# Altium project HV_Indicator.PrjPcb
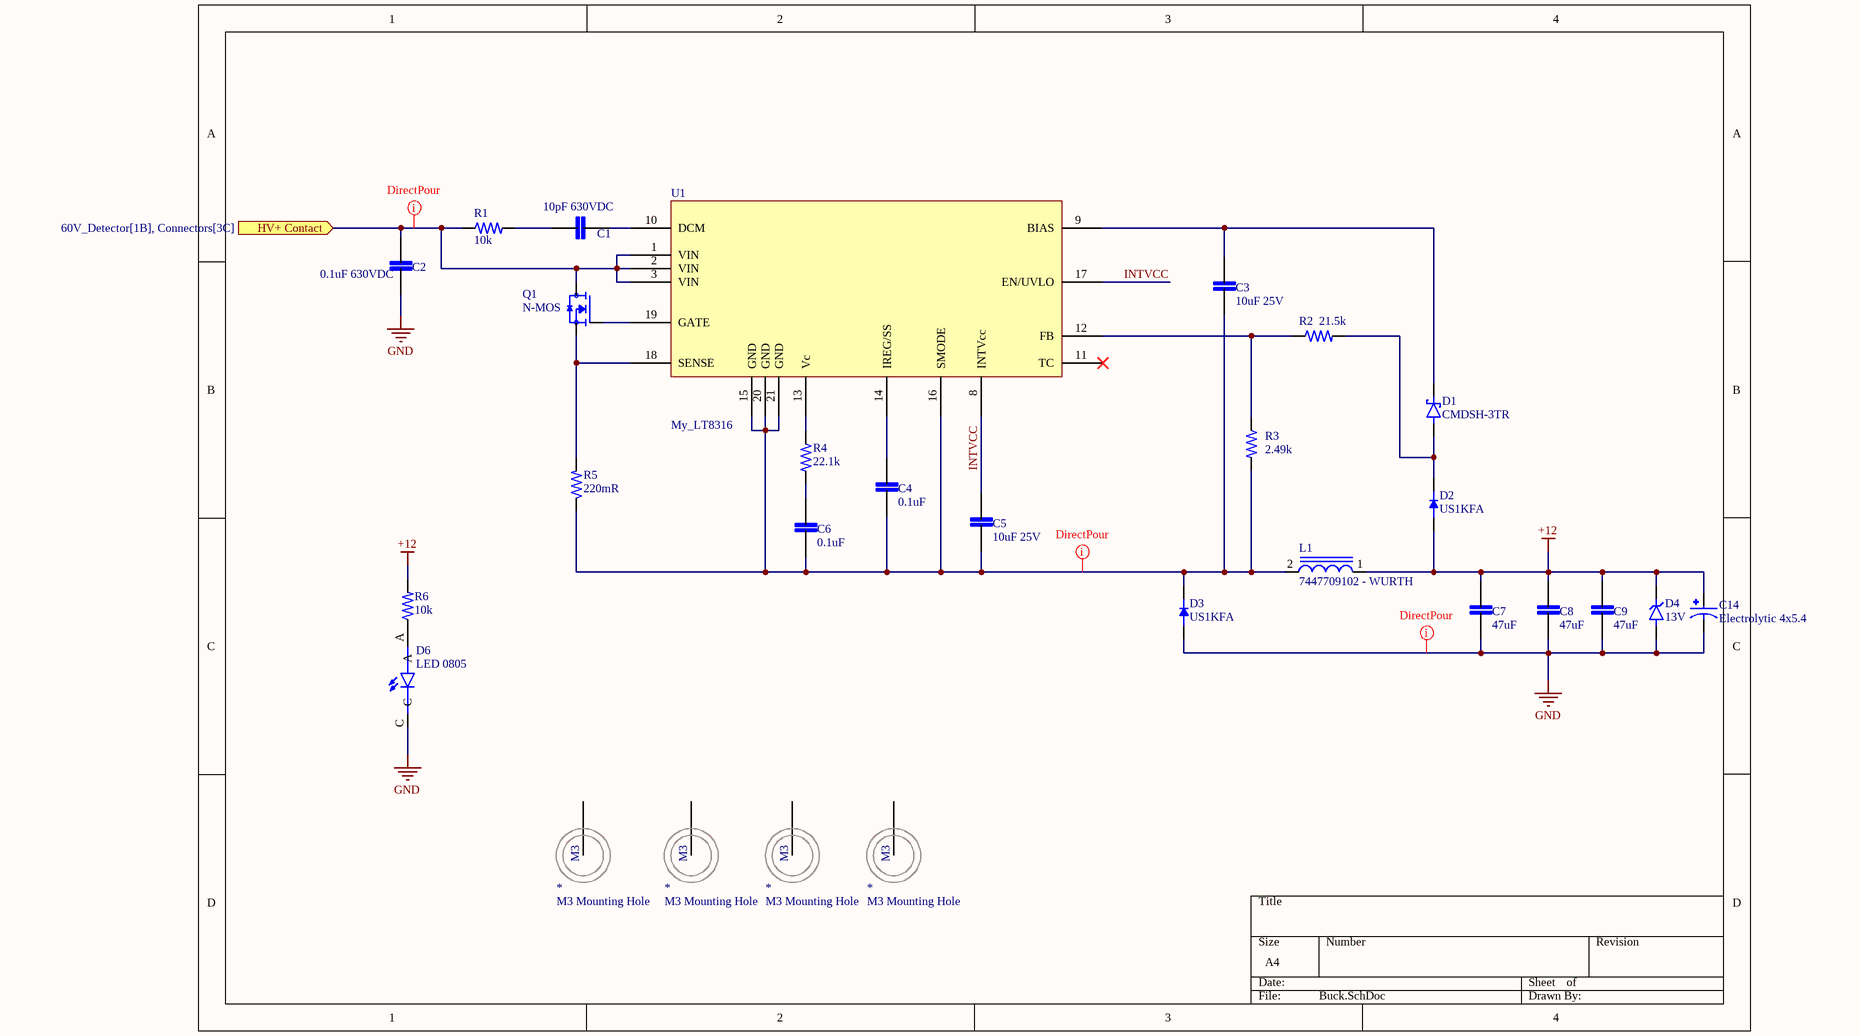
[diagram p0: Buck.SchDoc]
4 sheets, 60 parts. Net scope: flat (ports and power ports of the same name join across sheets).
Board file: VoltageIndicator_V4.PcbDoc
Sheets:
  Buck.SchDoc
  60V_Detector.SchDoc
  Pre-Charge Detector.SchDoc
  Connectors.SchDoc

## Sheet Buck.SchDoc
size A4; SheetNumber: 1; SheetTotal: 4

### Parts
(Parts that share a designator on the sheet are numbered #1, #2 ... from top to bottom, then left to right.)
*#1  M3 Mounting Hole  [M3 - Mounting Hole]
*#2  M3 Mounting Hole  [M3 - Mounting Hole]
*#3  M3 Mounting Hole  [M3 - Mounting Hole]
*#4  M3 Mounting Hole  [M3 - Mounting Hole]
C1  10pF 630VDC  [0805]
C2  0.1uF 630VDC  [1812]
C3  10uF 25V  [0805]
C4  0.1uF  [0805]
C5  10uF 25V  [0805]
C6  0.1uF  [0805]
C7  47uF  [0805]
C8  47uF  [0805]
C9  47uF  [0805]
C14  Electrolytic 4x5.4  [Electrolytic 4x5.4]
D1  CMDSH-3TR  [SOD-323]
D2  US1KFA  [SOD123]
D3  US1KFA  [SOD123]
D4  13V  [SOD123]
D6  LED 0805  [LED 0805]
L1  7447709102 - WURTH  [7447709102 - WURTH]
Q1  N-MOS  [DPAK - MOSFET]
R1  10k  [0805]
R2  21.5k  [0805]
R3  2.49k  [0805]
R4  22.1k  [0805]
R5  220mR  [0805]
R6  10k  [0805]
U1  My_LT8316  [IC_LT8316EFE#PBF]

### Ports
HV+ Contact (in, see 60V_Detector[1B], Connectors[3C])

### Nets
+12: C7.2 C8.2 C9.2 C14.1 D2.1(K) D4.1(K) L1.1 R6.2
GND: C2.1 C7.1 C8.1 C9.1 C14.2 D3.1(K) D4.2(A) D6.C
INTVCC: C5.1 U1.8(INTVcc) U1.17(EN/UVLO)
NetC1_1: C1.1 R1.2
NetC1_2: C1.2 U1.10(DCM)
NetC2_2: C2.2 Q1.3(D) R1.1 U1.1(VIN) U1.2(VIN) U1.3(VIN) ; port HV+ Contact
NetC3_1: C3.1 D1.C U1.9(BIAS)
NetC3_2: C3.2 C4.1 C5.2 C6.1 D3.2(A) L1.2 R3.2 R5.1 U1.15(GND) U1.16(SMODE) U1.20(GND) U1.21(GND)
NetC4_2: C4.2 U1.14(IREG/SS)
NetC6_2: C6.2 R4.2
NetD1_A: D1.A D2.2(A) R2.2
NetD6_A: D6.A R6.1
NetQ1_1: Q1.1(G) U1.19(GATE)
NetQ1_2: Q1.2(S) R5.2 U1.18(SENSE)
NetR2_1: R2.1 R3.1 U1.12(FB)
NetR4_1: R4.1 U1.13(Vc)

Not connected (* = marked no-connect by the designer): *#1 1(M3); *#2 1(M3); *#3 1(M3); *#4 1(M3); U1 11(TC)*

### Layout directives
net class DirectPour: GND, NetC2_2, NetC3_2

### Library data of the parts
C1 C3-C9 = 0805_Capacitor: MP: LD051A121KAB2A; MF: AVX; SnapEDA_Link: https://www.snapeda.com/parts/LD051A121KAB2A/AVX/view-part/?ref=snap; Package: 0805 AVX; Check_prices: https://www.snapeda.com/parts/LD051A121KAB2A/AVX/view-part/?ref=eda; Purchase-URL: https://pricing.snapeda.com/search/part/LD051A121KAB2A/?ref=eda; Price: None; Value: *; Availability: In Stock
C2 = 1812_Capacitor: MP: LD051A121KAB2A; MF: AVX; SnapEDA_Link: https://www.snapeda.com/parts/LD051A121KAB2A/AVX/view-part/?ref=snap; Package: 0805 AVX; Check_prices: https://www.snapeda.com/parts/LD051A121KAB2A/AVX/view-part/?ref=eda; Purchase-URL: https://pricing.snapeda.com/search/part/LD051A121KAB2A/?ref=eda; Price: None; Value: *; Availability: In Stock
C14 = Electrolytic 4x5.4: MF: Panasonic; MP: EEE-HA1E100WR; Package: RADIAL-2 Panasonic; Check_prices: https://www.snapeda.com/parts/EEE-HA1E100WR/Panasonic/view-part/778519/?ref=eda; Value: *; Price: None; Purchase-URL: https://pricing.snapeda.com/search/part/EEE-HA1E100WR/?ref=eda; SnapEDA_Link: https://www.snapeda.com/parts/EEE-HA1E100WR/Panasonic/view-part/778519/?ref=snap; Availability: In Stock
D1 = CMDSH-3TR: Diode Schottky 30V 100mA Surface Mount SOD-323; MF: Central Semiconductor; Value: *; Package: SOD-323 Central Semiconductor; MP: CMDSH-3 TR; Price: None; SnapEDA_Link: https://www.snapeda.com/parts/CMDSH-3%20TR/Central%20Semiconductor%20Corp/view-part/447234/?ref=snap; Availability: Unavailable
D2 D3 = SOD123 - Rectifier Diode: MF: Diodes Inc.; MP: 1N4148W-7-F; Value: *; Availability: In Stock; Package: SOD-123 Fairchild Semiconductor; SnapEDA_Link: https://www.snapeda.com/parts/1N4148W-7-F/Diodes+Inc./view-part/?ref=snap; Price: None; Check_prices: https://www.snapeda.com/parts/1N4148W-7-F/Diodes+Inc./view-part/?ref=eda; Purchase-URL: https://pricing.snapeda.com/search/part/1N4148W-7-F/?ref=eda
D4 = SOD123 - Zener Diode: MP: 1SMA5926; MF: Taiwan Semiconductor; Package: SMA-2 Taiwan Semiconductor; Availability: In Stock; Purchase-URL: https://pricing.snapeda.com/search/part/1SMA5926/?ref=eda; SnapEDA_Link: https://www.snapeda.com/parts/1SMA5926/Taiwan+Semiconductor/view-part/?ref=snap; Price: None; Check_prices: https://www.snapeda.com/parts/1SMA5926/Taiwan+Semiconductor/view-part/?ref=eda; Value: *
D6 = LED 0805: LED Uni-Color Green 4-Pin Chip 0805 T/R; MP: 597-3305-607F; Availability: Unavailable; Value: *; Price: None; Package: None
L1 = 7447709102 - WURTH: 1000uH - 900mA; MF: Bourns; MP: SRR1260-680M; Package: Nonstandard Bourns; Value: *; Digi-Key_Purchase_URL: https://www.digikey.com/product-detail/en/bourns-inc/SRR1260-680M/SRR1260-680MCT-ND/2127423?utm_source=snapeda&utm_medium=aggregator&utm_campaign=symbol; Digi-Key_Part_Number: SRR1260-680MCT-ND; SnapEDA_Link: https://www.snapeda.com/parts/SRR1260-680M/Bourns/view-part/337191/?ref=snap
Q1 = N-MOS: D-PAK; MP: AO3402; MF: Alpha &; Digi-Key_Purchase_URL: https://www.digikey.ca/product-detail/en/alpha-omega-semiconductor-inc/AO3402/785-1002-1-ND/1855944?utm_source=snapeda&utm_medium=aggregator&utm_campaign=symbol; Value: *; Package: SOT-23 Alpha &amp; Omega Semiconductor; SnapEDA_Link: https://www.snapeda.com/parts/AO3402/Alpha%20&%20Omega%20Semiconductor%20Inc./view-part/564857/?ref=snap; Digi-Key_Part_Number: 785-1002-1-ND
R1-R6 = 0805_Resistor: Power_Rating: .25 W; MP: 2-2176053-0; Tolerance: 1%; Resistance: .33; MF: TE Connectivity; Price: None; Availability: In Stock; EU_RoHS_Compliance: Compliant with Exemptions; Package: 0805; Value: *; SnapEDA_Link: https://www.snapeda.com/parts/2-2176053-0/TE+Connectivity/view-part/?ref=snap; Check_prices: https://www.snapeda.com/parts/2-2176053-0/TE+Connectivity/view-part/?ref=eda

## Sheet 60V_Detector.SchDoc
size A4; SheetNumber: 2; SheetTotal: 4
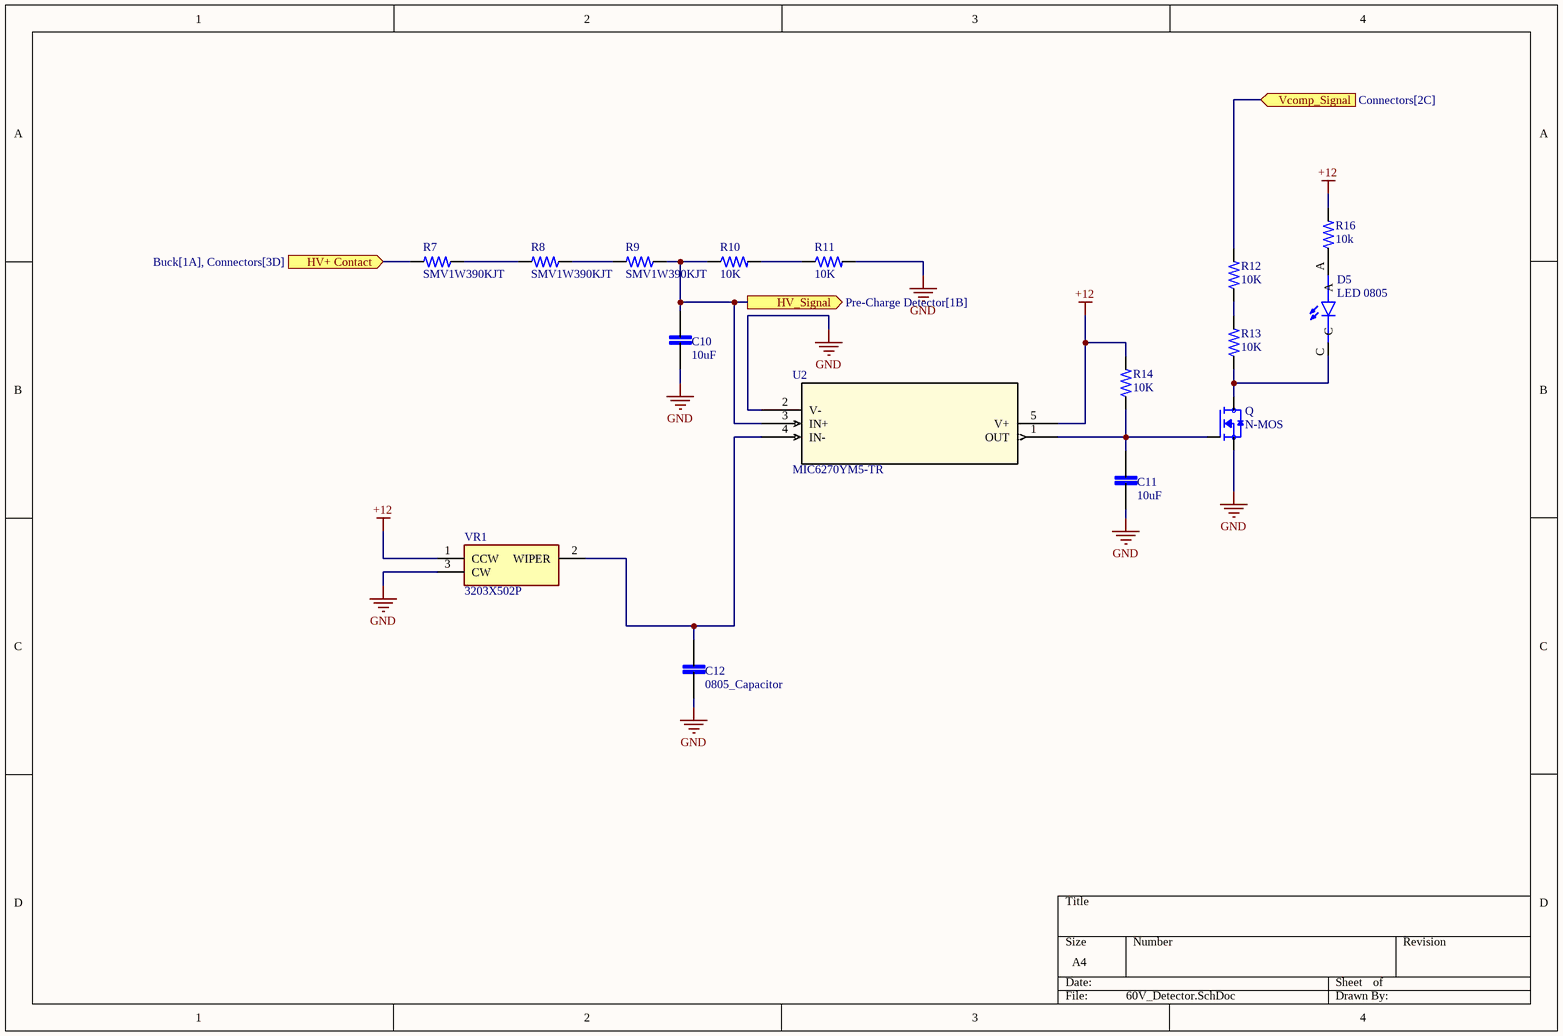
[diagram p1: 60V_Detector.SchDoc]

### Parts
C10  10uF  [0805]
C11  10uF  [0805]
C12  0805_Capacitor  [0805]
D5  LED 0805  [LED 0805]
Q  N-MOS  [AO3402]
R7  SMV1W390KJT  [SMV1W390KJT]
R8  SMV1W390KJT  [SMV1W390KJT]
R9  SMV1W390KJT  [SMV1W390KJT]
R10  10K  [0805]
R11  10K  [0805]
R12  10K  [0805]
R13  10K  [0805]
R14  10K  [0805]
R16  10k  [0805]
U2  MIC6270YM5-TR  [MIC6270]
VR1  3203X502P  [3203X502P]

### Ports
HV+ Contact (in, see Buck[1A], Connectors[3D]), HV_Signal (out, see Pre-Charge Detector[1B]), Vcomp_Signal (in, see Connectors[2C])

### Nets
+12: R14.2 R16.2 U2.5(V+) VR1.1(CCW)
GND: C10.1 C11.1 C12.1 Q.2(S) R11.2 U2.2(V-) VR1.3(CW)
NetC2_2: R7.2 ; port HV+ Contact
NetC10_2: C10.2 R9.1 R10.1 U2.3(IN+) ; port HV_Signal
NetC11_2: C11.2 Q.1(G) R14.1 U2.1(OUT)
NetC12_2: C12.2 U2.4(IN-) VR1.2(WIPER)
NetD5_A: D5.A R16.1
NetD5_C: D5.C Q.3(D) R13.1
NetJ3_1: R12.2 ; port Vcomp_Signal
NetR7_1: R7.1 R8.2
NetR8_1: R8.1 R9.2
NetR10_2: R10.2 R11.1
NetR12_1: R12.1 R13.2

### Library data of the parts
C10-C12 = 0805_Capacitor: MP: LD051A121KAB2A; MF: AVX; SnapEDA_Link: https://www.snapeda.com/parts/LD051A121KAB2A/AVX/view-part/?ref=snap; Package: 0805 AVX; Check_prices: https://www.snapeda.com/parts/LD051A121KAB2A/AVX/view-part/?ref=eda; Purchase-URL: https://pricing.snapeda.com/search/part/LD051A121KAB2A/?ref=eda; Price: None; Value: *; Availability: In Stock
D5 = LED 0805: as D6 on sheet Buck; Availability: Unavailable; Value: *; Price: None; Package: None
Q = N-MOS: D-PAK; MF: Alpha &; Digi-Key_Purchase_URL: https://www.digikey.ca/product-detail/en/alpha-omega-semiconductor-inc/AO3402/785-1002-1-ND/1855944?utm_source=snapeda&utm_medium=aggregator&utm_campaign=symbol; Value: *; MP: AO3402; Package: SOT-23 Alpha &amp; Omega Semiconductor; SnapEDA_Link: https://www.snapeda.com/parts/AO3402/Alpha%20&%20Omega%20Semiconductor%20Inc./view-part/564857/?ref=snap; Digi-Key_Part_Number: 785-1002-1-ND
R7-R9 = SMV1W390KJT: Power_Rating: .25 W; MP: 2-2176053-0; Tolerance: 1%; Resistance: .33; MF: TE Connectivity; Price: None; Availability: In Stock; EU_RoHS_Compliance: Compliant with Exemptions; Package: 0805; Value: *; SnapEDA_Link: https://www.snapeda.com/parts/2-2176053-0/TE+Connectivity/view-part/?ref=snap; Check_prices: https://www.snapeda.com/parts/2-2176053-0/TE+Connectivity/view-part/?ref=eda
R10-R14 R16 = 0805_Resistor: as R1 on sheet Buck; Price: None; Availability: In Stock; EU_RoHS_Compliance: Compliant with Exemptions; Package: 0805; Value: *; SnapEDA_Link: https://www.snapeda.com/parts/2-2176053-0/TE+Connectivity/view-part/?ref=snap; Check_prices: https://www.snapeda.com/parts/2-2176053-0/TE+Connectivity/view-part/?ref=eda
U2 = MIC6270YM5-TR: No Description Available; Mfr_Name: Microchip; Copyright: Copyright (C) 2024 Ultra Librarian. All rights reserved.; Manufacturer_Part_Number: MIC6270YM5-TR; RefDes: RefDes; Type: DEV
VR1 = 3203X502P: Variable Resistor; Manufacturer_Name: TE Connectivity; Datasheet Link: https://www.te.com/commerce/DocumentDelivery/DDEController?Action=showdoc&DocId=Customer+Drawing%7F1623916%7FBA1%7Fpdf%7FEnglish%7FENG_CD_1623916_BA1.pdf%7F1-1623916-0; Height: 2.1mm; Manufacturer_Part_Number: 3203X502P; Mouser Part Number: 279-3203X502P; Mouser Price/Stock: https://www.mouser.co.uk/ProductDetail/TE-Connectivity-Holsworthy/3203X502P?qs=GP7tGcbp1QQJNQgoJp42%2Fg%3D%3D; Arrow Part Number: 3203X502P; Arrow Price/Stock: https://www.arrow.com/en/products/3203x502p/te-connectivity?region=nac

## Sheet Pre-Charge Detector.SchDoc
size A4; SheetNumber: 3; SheetTotal: 4
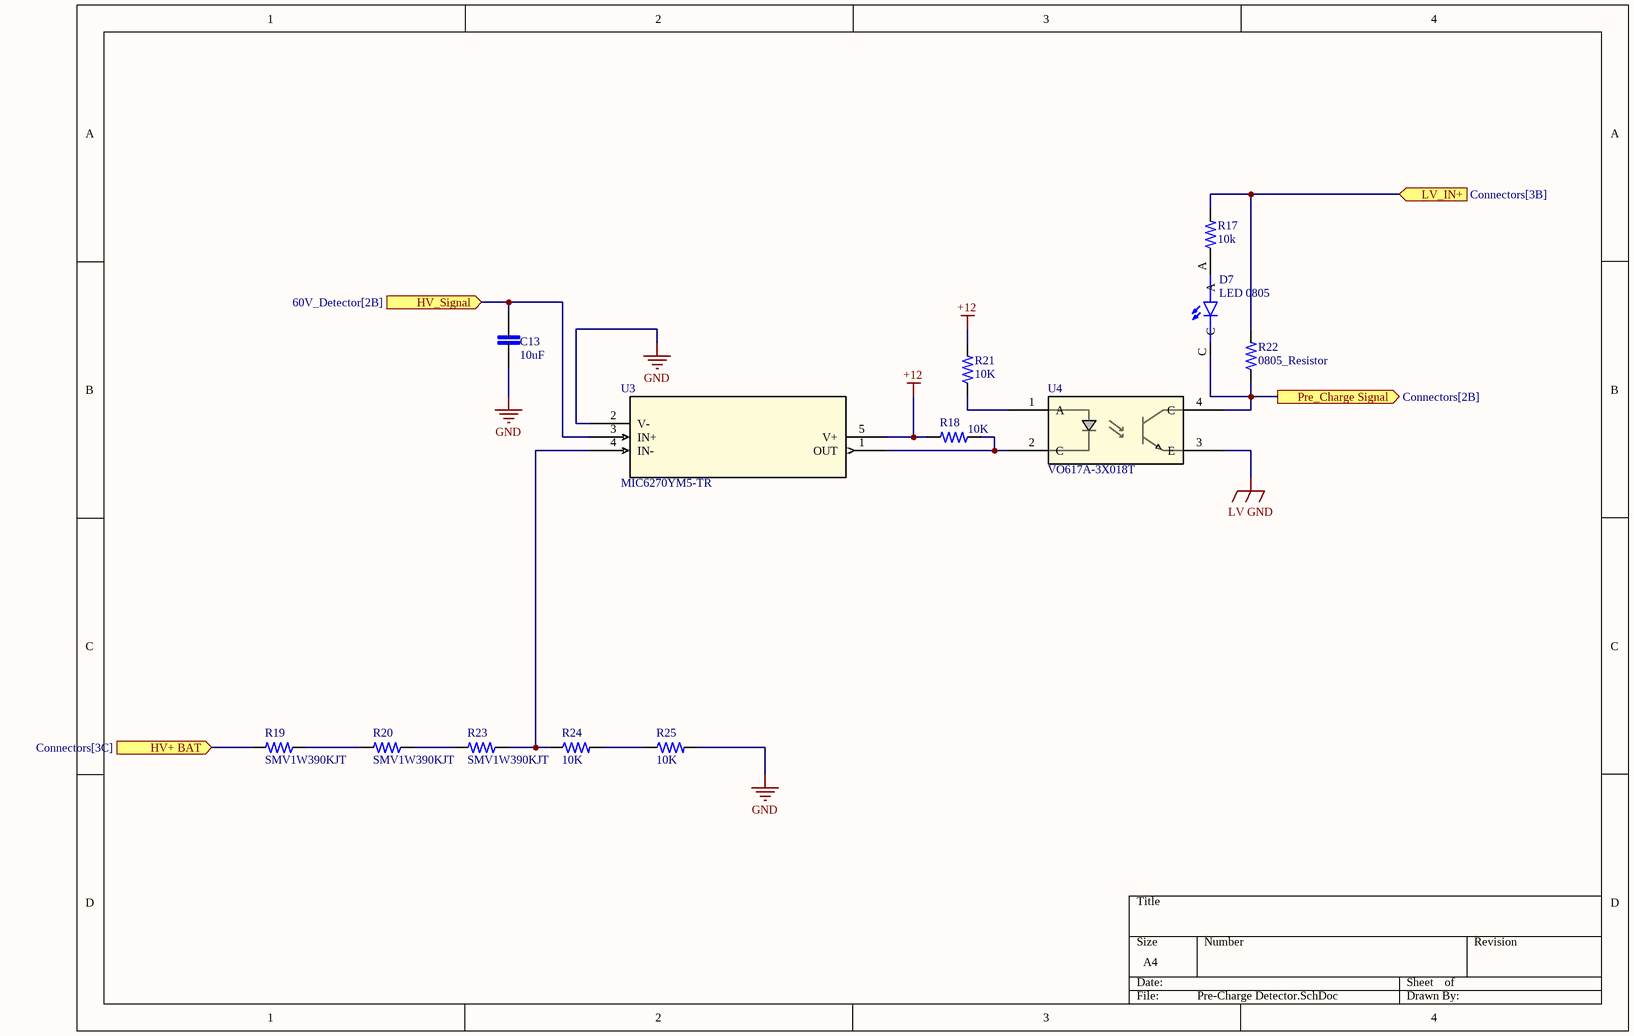
[diagram p2: Pre-Charge Detector.SchDoc]

### Parts
C13  10uF  [0805]
D7  LED 0805  [LED 0805]
R17  10k  [0805]
R18  10K  [0805]
R19  SMV1W390KJT  [SMV1W390KJT]
R20  SMV1W390KJT  [SMV1W390KJT]
R21  10K  [0805]
R22  0805_Resistor  [0805]
R23  SMV1W390KJT  [SMV1W390KJT]
R24  10K  [0805]
R25  10K  [0805]
U3  MIC6270YM5-TR  [MIC6270]
U4  VO617A-3X018T  [VO617A]

### Ports
HV+ BAT (in, see Connectors[3C]), HV_Signal (in, see 60V_Detector[2B]), LV_IN+ (in, see Connectors[3B]), Pre_Charge Signal (out, see Connectors[2B])

### Nets
+12: R18.2 R21.2 U3.5(V+)
GND: C13.1 R25.2 U3.2(V-)
LV GND: U4.3(E)
NetC10_2: C13.2 U3.3(IN+) ; port HV_Signal
NetD7_A: D7.A R17.1
NetD7_C: D7.C R22.1 U4.4(C) ; port Pre_Charge Signal
NetJ1_3: R19.2 ; port HV+ BAT
NetJ2_1: R17.2 R22.2 ; port LV_IN+
NetR18_1: R18.1 U3.1(OUT) U4.2(C)
NetR19_1: R19.1 R20.2
NetR20_1: R20.1 R23.2
NetR21_1: R21.1 U4.1(A)
NetR23_1: R23.1 R24.1 U3.4(IN-)
NetR24_2: R24.2 R25.1

### Library data of the parts
C13 = 0805_Capacitor: MP: LD051A121KAB2A; MF: AVX; SnapEDA_Link: https://www.snapeda.com/parts/LD051A121KAB2A/AVX/view-part/?ref=snap; Package: 0805 AVX; Check_prices: https://www.snapeda.com/parts/LD051A121KAB2A/AVX/view-part/?ref=eda; Purchase-URL: https://pricing.snapeda.com/search/part/LD051A121KAB2A/?ref=eda; Price: None; Value: *; Availability: In Stock
D7 = LED 0805: as D6 on sheet Buck; Availability: Unavailable; Value: *; Price: None; Package: None
R17 R18 R21 R22 R24 R25 = 0805_Resistor: as R1 on sheet Buck; Price: None; Availability: In Stock; EU_RoHS_Compliance: Compliant with Exemptions; Package: 0805; Value: *; SnapEDA_Link: https://www.snapeda.com/parts/2-2176053-0/TE+Connectivity/view-part/?ref=snap; Check_prices: https://www.snapeda.com/parts/2-2176053-0/TE+Connectivity/view-part/?ref=eda
R19 R20 R23 = SMV1W390KJT: as R7 on sheet 60V_Detector; Price: None; Availability: In Stock; EU_RoHS_Compliance: Compliant with Exemptions; Package: 0805; Value: *; SnapEDA_Link: https://www.snapeda.com/parts/2-2176053-0/TE+Connectivity/view-part/?ref=snap; Check_prices: https://www.snapeda.com/parts/2-2176053-0/TE+Connectivity/view-part/?ref=eda
U3 = MIC6270YM5-TR: as U2 on sheet 60V_Detector; Copyright: Copyright (C) 2024 Ultra Librarian. All rights reserved.; Manufacturer_Part_Number: MIC6270YM5-TR; RefDes: RefDes; Type: DEV
U4 = VO617A: VO617A-3X018T Optocoupler Dc-in 1-CH Transistor Dc-out 4-PIN PDIP SMD T/r; NexarPartId: 68099910; Number of Channels: 1

## Sheet Connectors.SchDoc
size A4; SheetNumber: 4; SheetTotal: 4
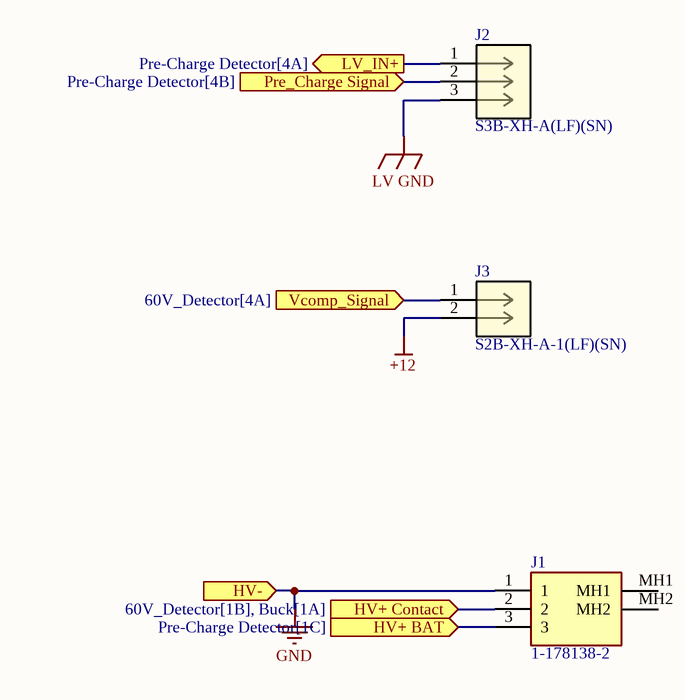
[diagram p3: Connectors.SchDoc]

### Parts
J1  1-178138-2  [11781382]
J2  S3B-XH-A(LF)(SN)  [3P JST XH2.54mm 90º]
J3  S2B-XH-A-1(LF)(SN)  [2P JST XH2.54mm 90º]

### Ports
HV+ BAT (in, see Pre-Charge Detector[1C]), HV+ Contact (in, see 60V_Detector[1B], Buck[1A]), HV- (in), LV_IN+ (out, see Pre-Charge Detector[4A]), Pre_Charge Signal (in, see Pre-Charge Detector[4B]), Vcomp_Signal (in, see 60V_Detector[4A])

### Nets
+12: J3.2
GND: J1.1 ; port HV-
LV GND: J2.3
NetC2_2: J1.2 ; port HV+ Contact
NetD7_C: J2.2 ; port Pre_Charge Signal
NetJ1_3: J1.3 ; port HV+ BAT
NetJ2_1: J2.1 ; port LV_IN+
NetJ3_1: J3.1 ; port Vcomp_Signal

Not connected (* = marked no-connect by the designer): J1 MH1 MH2

### Library data of the parts
J1 = 1-178138-2: Connector; Manufacturer_Name: TE Connectivity; Datasheet Link: https://www.te.com/commerce/DocumentDelivery/DDEController?Action=showdoc&DocId=Customer+Drawing%7F178138%7FE1%7Fpdf%7FEnglish%7FENG_CD_178138_E1.pdf%7F1-178138-2; Height: 11.25mm; Manufacturer_Part_Number: 1-178138-2; Mouser Part Number: 571-1-178138-2; Mouser Price/Stock: https://www.mouser.co.uk/ProductDetail/TE-Connectivity/1-178138-2?qs=CUq%2FfiVWgpCdbQR47qZ9jg%3D%3D; Arrow Part Number: 1-178138-2; Arrow Price/Stock: https://www.arrow.com/en/products/1-178138-2/te-connectivity?region=europe
J2 = 3P JST XH2.54mm 90º: No Description Available; Mfr_Name: JST; Copyright: Copyright (C) 2024 Ultra Librarian. All rights reserved.; Manufacturer_Part_Number: S3B-XH-A(LF)(SN); RefDes: RefDes; Type: DEV
J3 = 2P JST XH2.54mm 90º: No Description Available; Mfr_Name: JST; Copyright: Copyright (C) 2024 Ultra Librarian. All rights reserved.; Manufacturer_Part_Number: S2B-XH-A-1(LF)(SN); RefDes: RefDes; Type: DEV

## Nets that join several sheets
+12: Buck (8 pins), 60V_Detector (R14.2 R16.2 U2.5 VR1.1), Pre-Charge Detector (R18.2 R21.2 U3.5), Connectors (J3.2)
GND: Buck (8 pins), 60V_Detector (7 pins), Pre-Charge Detector (C13.1 R25.2 U3.2), Connectors (J1.1)
LV GND: Pre-Charge Detector (U4.3), Connectors (J2.3)
NetC2_2: Buck (6 pins), 60V_Detector (R7.2), Connectors (J1.2)
NetC10_2: 60V_Detector (C10.2 R9.1 R10.1 U2.3), Pre-Charge Detector (C13.2 U3.3)
NetD7_C: Pre-Charge Detector (D7.C R22.1 U4.4), Connectors (J2.2)
NetJ1_3: Pre-Charge Detector (R19.2), Connectors (J1.3)
NetJ2_1: Pre-Charge Detector (R17.2 R22.2), Connectors (J2.1)
NetJ3_1: 60V_Detector (R12.2), Connectors (J3.1)